# EAGLE design programador (EAGLE 9.6.1)
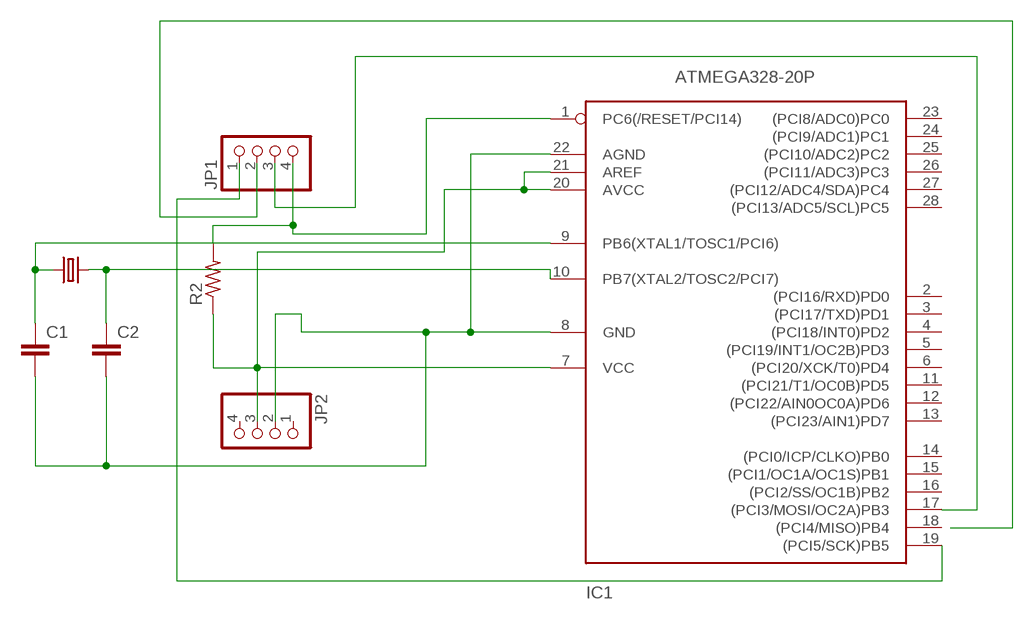
[diagram p0: schematic, sheet 1]

## Parts
C1  C5/3.5  [C5B3.5]
C2  C5/3.5  [C5B3.5]
IC1  ATMEGA328-20P  [DIL28-3]
JP1  PINHD-1X4  [1X04]
JP2  PINHD-1X4  [1X04]
Q1  CRYSTALHC49S  [HC49/S]
R2  R-US_0207/10  [0207/10]

## Nets
GND: C1.2 C2.2 IC1.8(GND) IC1.22(AGND) JP2.2
N$1: IC1.7(VCC) IC1.20(AVCC) IC1.21(AREF) JP2.3 R2.1
N$2: IC1.19((PCI5/SCK)PB5) JP1.1
N$3: IC1.1(PC6(/RESET/PCI14)) JP1.4 R2.2
N$4: C2.1 IC1.10(PB7(XTAL2/TOSC2/PCI7)) Q1.2
N$5: C1.1 IC1.9(PB6(XTAL1/TOSC1/PCI6)) Q1.1
N$6: JP1.2
N$7: IC1.17((PCI3/MOSI/OC2A)PB3) JP1.3
Unconnected: IC1.2((PCI16/RXD)PD0) IC1.3((PCI17/TXD)PD1) IC1.4((PCI18/INT0)PD2) IC1.5((PCI19/INT1/OC2B)PD3) IC1.6((PCI20/XCK/T0)PD4) IC1.11((PCI21/T1/OC0B)PD5) IC1.12((PCI22/AIN0OC0A)PD6) IC1.13((PCI23/AIN1)PD7) IC1.14((PCI0/ICP/CLKO)PB0) IC1.15((PCI1/OC1A/OC1S)PB1) IC1.16((PCI2/SS/OC1B)PB2) IC1.18((PCI4/MISO)PB4) IC1.23((PCI8/ADC0)PC0) IC1.24((PCI9/ADC1)PC1) IC1.25((PCI10/ADC2)PC2) IC1.26((PCI11/ADC3)PC3) IC1.27((PCI12/ADC4/SDA)PC4) IC1.28((PCI13/ADC5/SCL)PC5) JP2.1 JP2.4

## Library data of the parts
C1 C2 = capacitor-wima:C: CAPACITOR naming: grid - package width
IC1 = atmega328:ATMEGA328*P: MICROCONTROLLER 32 kBytes FLASH 2 kBytes SRAM 1 kBytes EEPROM USART 8-channel 10 bit ADC
JP1 JP2 = pinhead:PINHD-1X4: PIN HEADER
Q1 = crystal:CRYSTAL: CRYSTAL; OC_FARNELL: 1667008; OC_NEWARK: unknown
R2 = rcl:R-US_: RESISTOR, American symbol; SPICEPREFIX: R

## Board
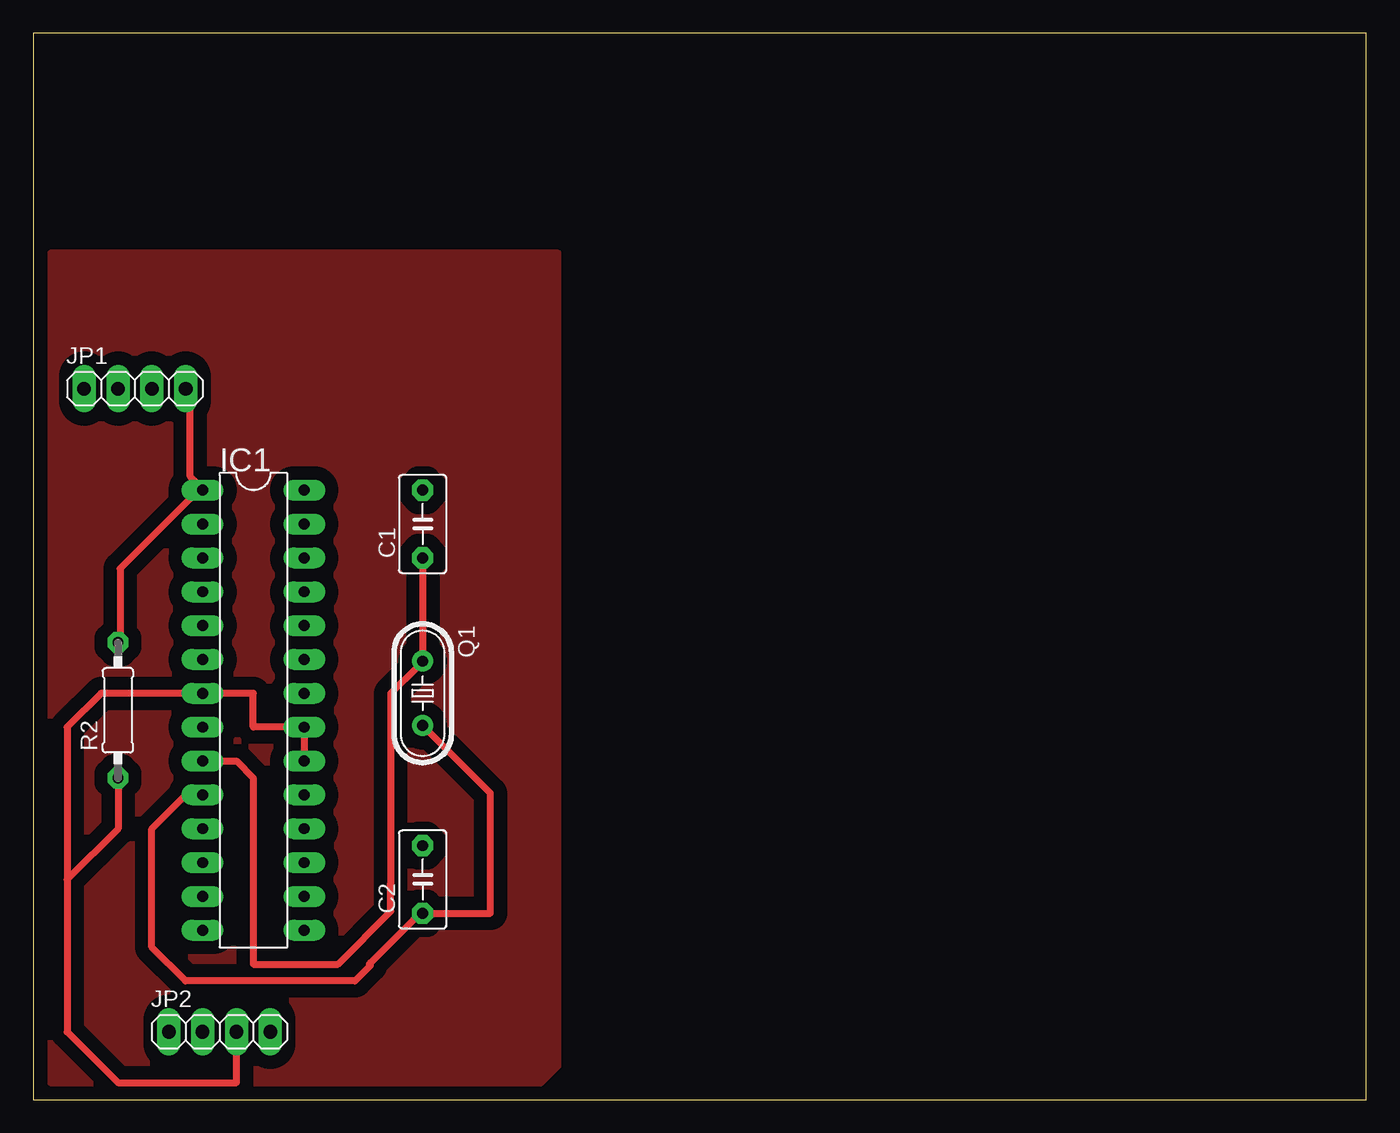
[diagram p1: board, top side]
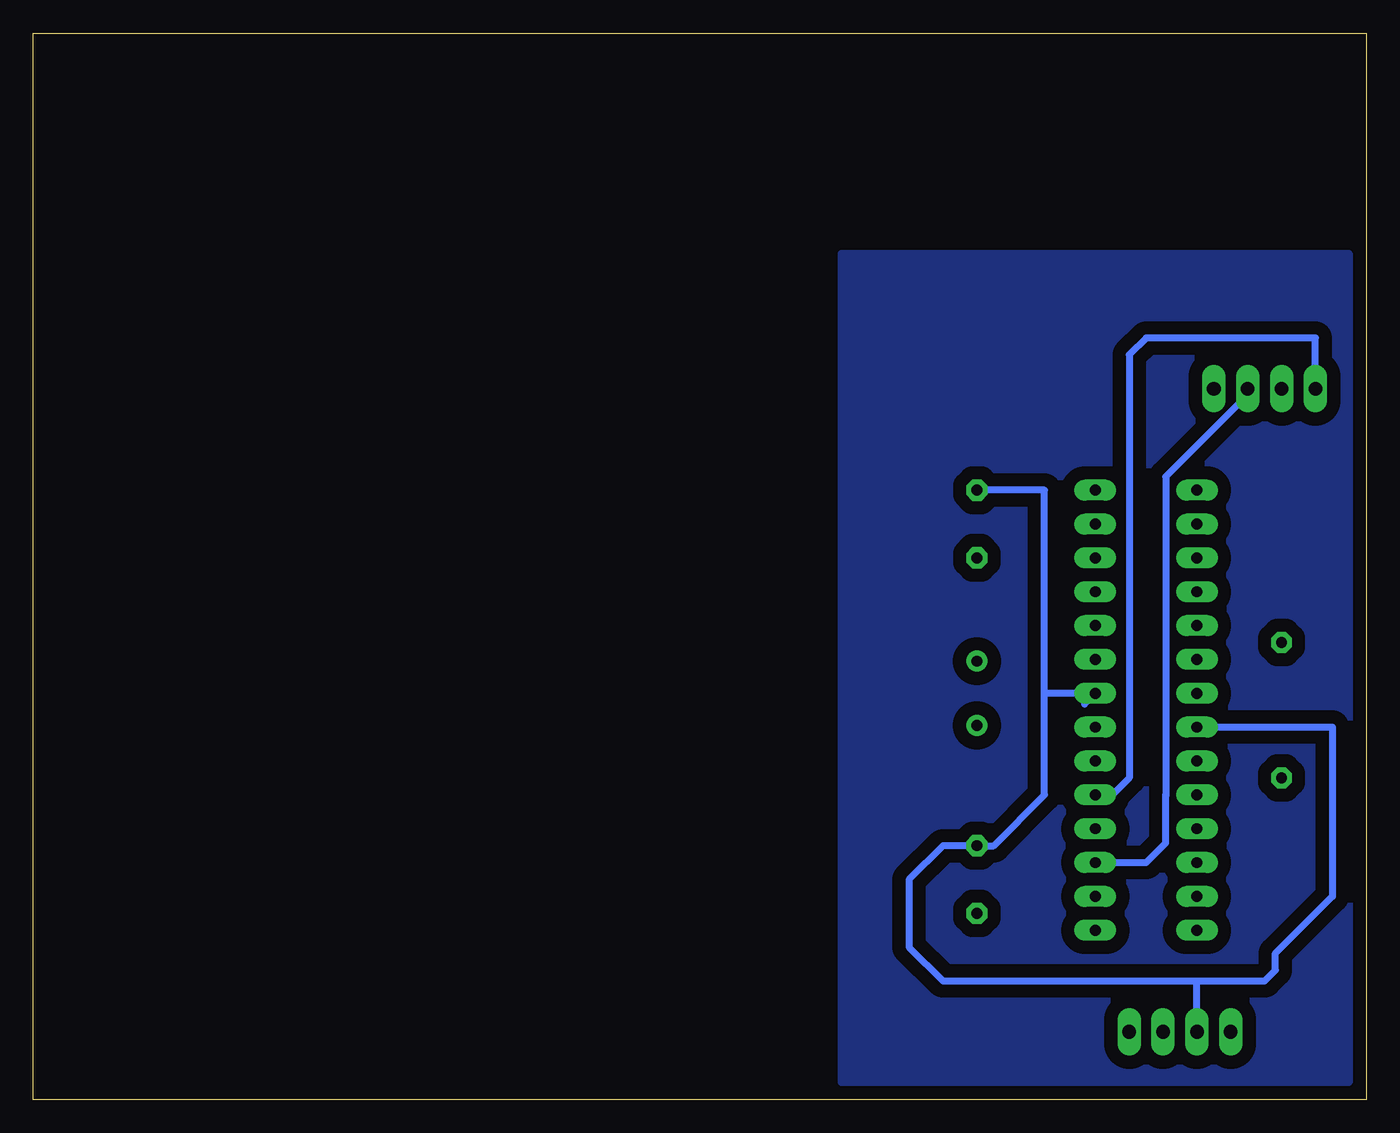
[diagram p2: board, bottom side, seen from below]

Size 100 x 80 mm. Coordinates in mm from the lower left corner, seen from the top.
Outline: 0,0 100,0 100,80 0,80 0,0
Copper layers (1*16): Top 0.035mm / dielectric 1.5mm / Bottom 0.035mm
Design rules "default *": minimum track width 20mil, minimum drill 0.35mm, track to track 12mil, track to pad 12mil, pad to pad 6mil, via to via 6mil, smd to smd 6mil, copper to edge 40mil, drill to drill 6mil, minimum pad ring 15mil, minimum via ring 8mil, stop-mask expansion 4mil, vias tented up to drill 0mil, thermal gap 10mil

### Footprints (pad centres in the part's own frame; a part is rotated, then mirrored left to right if it is on the bottom)
C5B3.5 = drill 0.813 pad 1.6 octagon: 1 -2.54,0; 2 2.54,0
DIL28-3 = drill 0.813 long: 1 -16.51,-3.81; 2 -13.97,-3.81; 3 -11.43,-3.81; 4 -8.89,-3.81; 5 -6.35,-3.81; 6 -3.81,-3.81; 7 -1.27,-3.81; 8 1.27,-3.81; 9 3.81,-3.81; 10 6.35,-3.81; 11 8.89,-3.81; 12 11.43,-3.81; 13 13.97,-3.81; 14 16.51,-3.81; 15 16.51,3.81; 16 13.97,3.81; 17 11.43,3.81; 18 8.89,3.81; 19 6.35,3.81; 20 3.81,3.81; 21 1.27,3.81; 22 -1.27,3.81; 23 -3.81,3.81; 24 -6.35,3.81; 25 -8.89,3.81; 26 -11.43,3.81; 27 -13.97,3.81; 28 -16.51,3.81
1X04 = drill 1.016 long: 1 -3.81,0; 2 -1.27,0; 3 1.27,0; 4 3.81,0
HC49/S = drill 0.813: 1 -2.413,0; 2 2.413,0
0207/10 = drill 0.813 octagon: 1 -5.08,0; 2 5.08,0

### Placement (x,y rotation side)
C1  29.21,43.18 90 top
C2  29.21,16.51 90 top
IC1  16.51,29.21 270 top
JP1  7.62,53.34 0 top
JP2  13.97,5.08 0 top
Q1  29.21,30.48 270 top
R2  6.35,29.21 90 top

### Tracks (layer width: path | path; a pad name or v marks a point on that pad's centre or on a via)
BOTOM
  pour Bottom (isolate 1): 1.27,63.5 1.27,1.27 39.37,1.27 39.37,63.5
GND
  Bottom 0.508: 12.6,27.64 IC1.8 2.54,27.94 2.54,15.24 6.81,10.97 6.81,9.7 7.62,8.89 12.7,8.89 | 13.01,5.28 JP2.2 12.7,8.89 | 21.13,29.67 IC1.22 24.13,30.48 | 28.85,19.1 C2.2 | 28.85,45.52 C1.2 24.13,45.72 24.13,30.48 | 29.26,18.69 C2.2 | C2.2 31.75,19.05 34.29,16.51 34.29,11.43 31.75,8.89 12.7,8.89 | C2.2 27.94,19.05 24.13,22.86 24.13,30.48
N$1
  Top 0.508: IC1.21 IC1.20 | IC1.7 12.19,30.48 | 6.5,24.38 R2.1 | 6.5,23.98 R2.1 | 20.32,28.04 IC1.21 | JP2.3 15.24,1.27 6.35,1.27 2.54,5.08 2.54,16.51 | 2.54,16.51 2.54,27.94 5.08,30.48 IC1.7 | R2.1 6.35,20.32 2.54,16.51 | IC1.21 16.51,27.94 16.51,30.48 IC1.7
N$2
  Bottom 0.508: 19.51,23.16 20.32,23.16 IC1.19 19.05,22.86 17.78,24.13 17.78,55.88 16.51,57.15 3.81,57.15 JP1.1 3.66,53.65
N$3
  Top 0.508: 12.6,45.92 6.5,39.83 6.5,34.54 R2.2 | 12.6,45.92 11.79,46.74 11.79,53.24 JP1.4 | 12.6,45.92 IC1.1
N$4
  Top 0.508: 25.3,10.26 28.85,13.82 C2.1 | 25.3,10.26 25.2,10.16 | 13.01,22.76 IC1.10 11.43,22.86 8.89,20.32 8.89,11.43 11.43,8.89 24.13,8.89 25.3,10.06 25.3,10.26 | 28.85,28.04 Q1.2 34.29,22.99 34.29,13.97 C2.1 | 28.85,14.22 C2.1
N$5
  Top 0.508: 13.01,25.2 IC1.9 15.24,25.4 16.51,24.13 16.51,10.16 22.86,10.16 26.82,14.12 26.82,16.26 26.82,16.51 26.82,30.48 28.85,32.51 Q1.1 29.26,32.92 29.26,40.64 C1.1
N$7
  Bottom 0.508: 20.32,17.88 IC1.17 16.51,17.78 15.04,19.25 15.04,22.76 15.04,22.86 15.04,46.74 8.53,53.24 JP1.3
TOP
  pour Top (isolate 1): 1.27,63.5 1.27,1.27 38.1,1.27 39.37,2.54 39.37,63.5